# EAGLE design SUSTAINA-Power-Logging-Board (EAGLE 9.6.2)
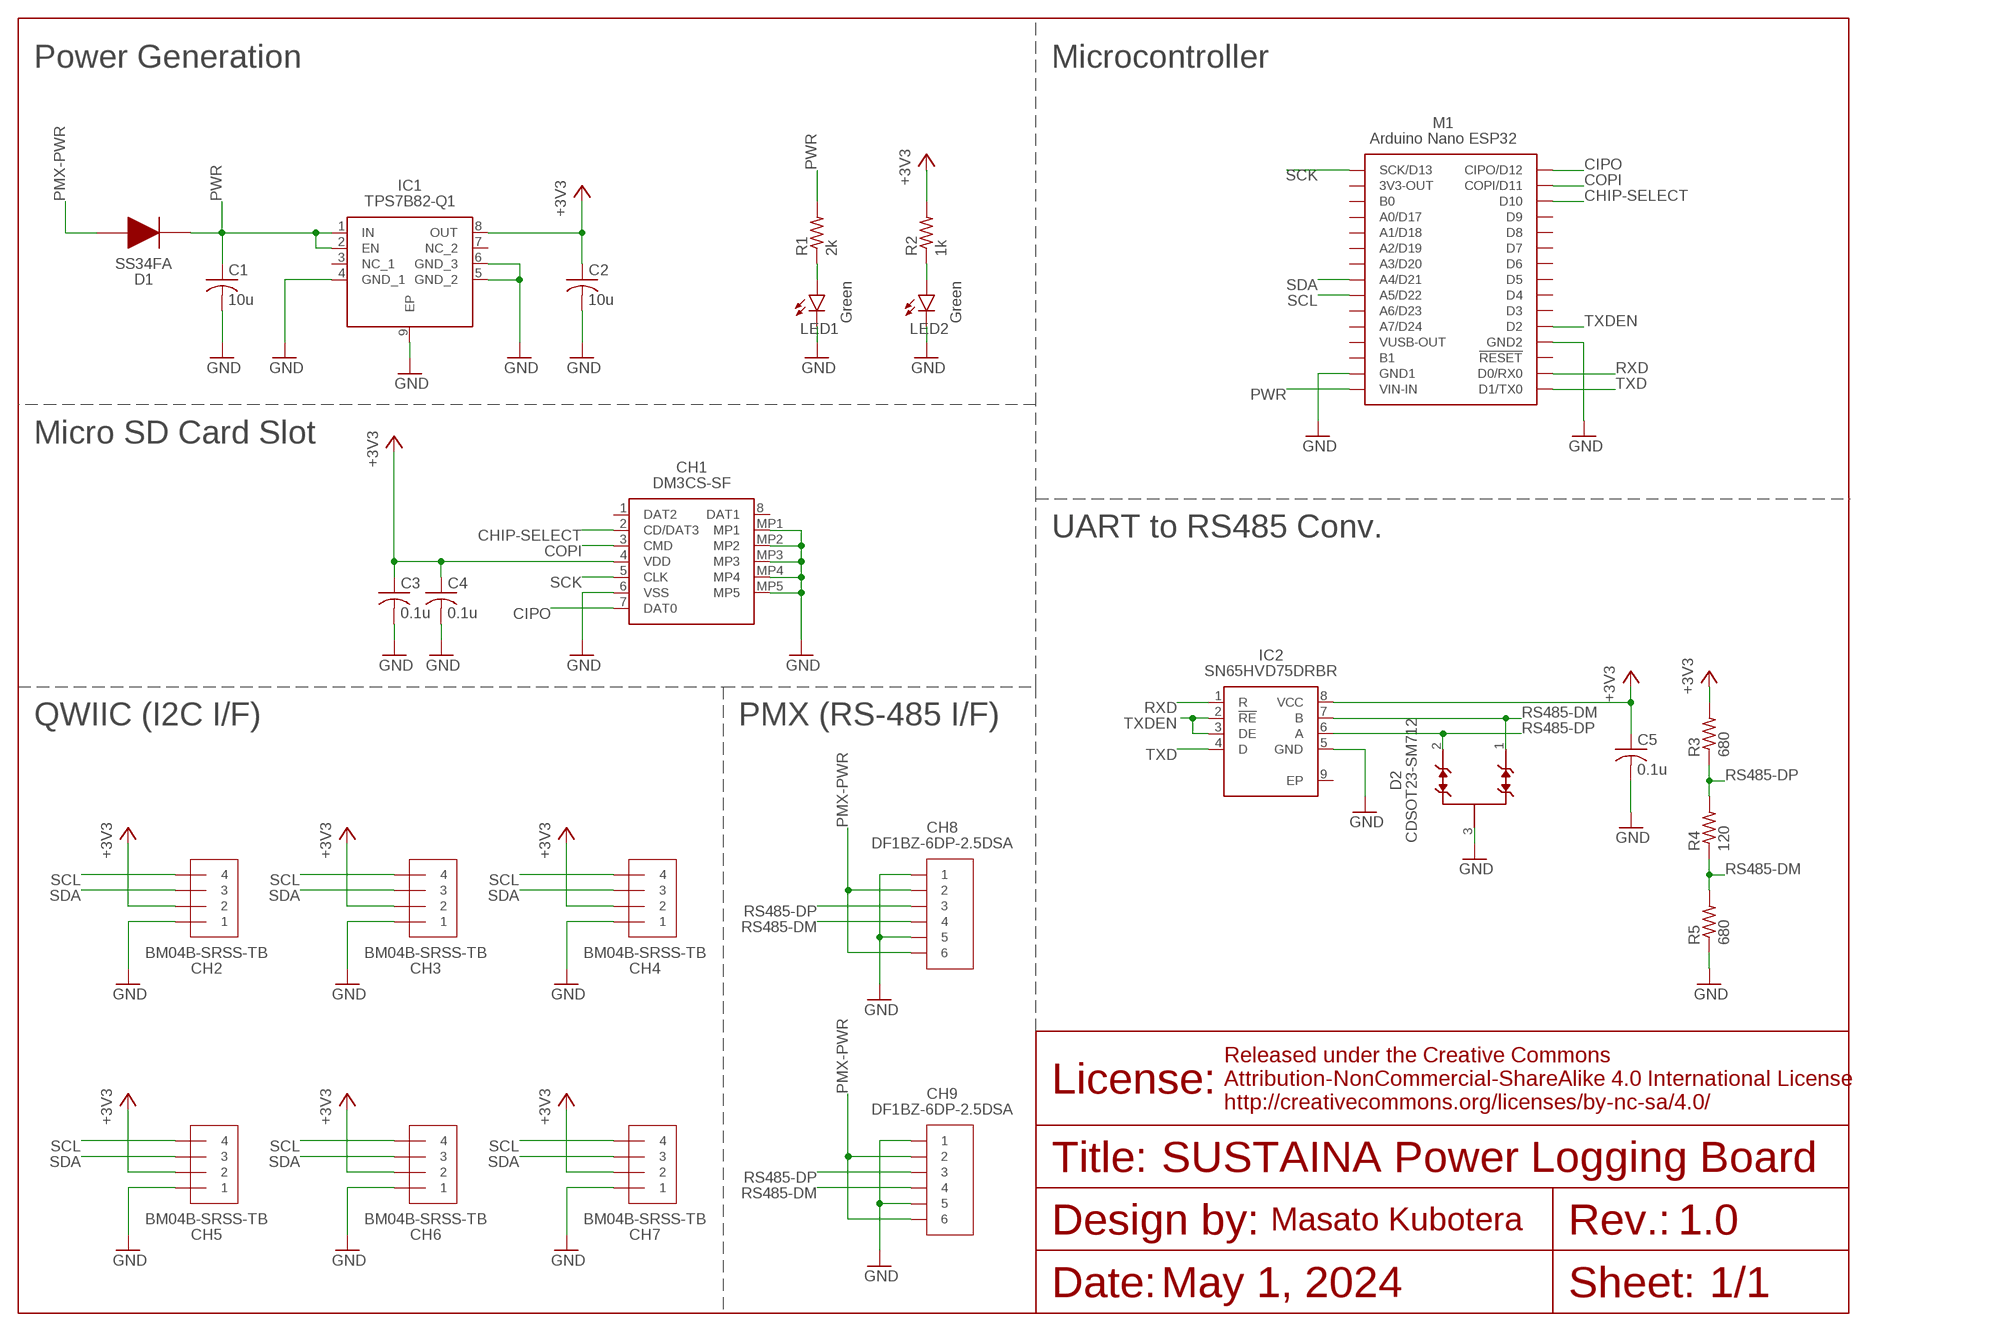
[diagram p0: schematic, sheet 1]

## Parts
C1  10u  C-USC0603  [C0603]
C2  10u  C-USC0603  [C0603]
C3  0.1u  C-USC0603  [C0603]
C4  0.1u  C-USC0603  [C0603]
C5  0.1u  C-USC0603  [C0603]
CH1  DM3CS-SF  [DM3CS-SF]
CH2  BM04B-SRSS-TB  [BM04B-SRSS-TB]
CH3  BM04B-SRSS-TB  [BM04B-SRSS-TB]
CH4  BM04B-SRSS-TB  [BM04B-SRSS-TB]
CH5  BM04B-SRSS-TB  [BM04B-SRSS-TB]
CH6  BM04B-SRSS-TB  [BM04B-SRSS-TB]
CH7  BM04B-SRSS-TB  [BM04B-SRSS-TB]
CH8  DF1BZ-6DP-25DSA  [DF1BZ-6DP-25DSA]
CH9  DF1BZ-6DP-25DSA  [DF1BZ-6DP-25DSA]
D1  SS34FA  [SS34FA]
D2  CDSOT23-SM712  [SOT-23-3]
IC1  TPS7B82-Q1  [SOP65P490X110-9N]
IC2  SN65HVD75DRBR  [SON65P300X300X100-9N]
LED1  Green  LEDSML0603  [SML0603]
LED2  Green  LEDSML0603  [SML0603]
M1  NANO-ESP32  [NANO-ESP32]
R1  2k  R-US_R0603  [R0603]
R2  1k  R-US_R0603  [R0603]
R3  680  R-US_R0603  [R0603]
R4  120  R-US_R0603  [R0603]
R5  680  R-US_R0603  [R0603]

## Nets
+3V3 [power]: C2.1 C3.1 C4.1 C5.1 CH1.4(VDD) CH2.2 CH3.2 CH4.2 CH5.2 CH6.2 CH7.2 IC1.8(OUT) IC2.8(VCC) R2.2 R3.2
CHIP-SELECT [signal]: CH1.2(CD/DAT3) M1.D10
CIPO [signal]: CH1.7(DAT0) M1.CIPO/D12
COPI [signal]: CH1.3(CMD) M1.COPI/D11
GND [power]: C1.2 C2.2 C3.2 C4.2 C5.2 CH1.6(VSS) CH1.MP1 CH1.MP2 CH1.MP3 CH1.MP4 CH1.MP5 CH2.1 CH3.1 CH4.1 CH5.1 CH6.1 CH7.1 CH8.1 CH8.5 CH9.1 CH9.5 D2.3 IC1.4(GND_1) IC1.5(GND_2) IC1.6(GND_3) IC1.9(EP) IC2.5(GND) LED1.C LED2.C M1.GND1 M1.GND2 R5.1
LED-3V3 [low-power]: LED2.A R2.1
LED-PWR [low-power]: LED1.A R1.1
PMX-PWR [high-power]: CH8.2 CH8.6 CH9.2 CH9.6 D1.2
PWR [high-power]: C1.1 D1.1 IC1.1(IN) IC1.2(EN) M1.VIN-IN R1.2
RS485-DM [signal]: CH8.4 CH9.4 D2.1 IC2.7(B) R4.1 R5.2
RS485-DP [signal]: CH8.3 CH9.3 D2.2 IC2.6(A) R3.1 R4.2
RXD [signal]: IC2.1(R) M1.D0/RX0
SCK [signal]: CH1.5(CLK) M1.SCK/D13
SCL [signal]: CH2.4 CH3.4 CH4.4 CH5.4 CH6.4 CH7.4 M1.A5/D22
SDA [signal]: CH2.3 CH3.3 CH4.3 CH5.3 CH6.3 CH7.3 M1.A4/D21
TXD [signal]: IC2.4(D) M1.D1/TX0
TXDEN [signal]: IC2.2(!RE) IC2.3(DE) M1.D2
Unconnected: CH1.1(DAT2) CH1.8(DAT1) IC1.3(NC_1) IC1.7(NC_2) IC2.9(EP) M1.3V3-OUT M1.!RESET M1.A0/D17 M1.A1/D18 M1.A2/D19 M1.A3/D20 M1.A6/D23 M1.A7/D24 M1.B0 M1.B1 M1.D3 M1.D4 M1.D5 M1.D6 M1.D7 M1.D8 M1.D9 M1.VUSB-OUT

## Notes on the sheet
- Power Generation | Microcontroller
- Micro SD Card Slot
- UART to RS485 Conv.
- QWIIC (I2C I/F) | PMX (RS-485 I/F)
- SUSTAINA Power Logging Board
- 1.0
- May 1, 2024 | 1/1

## Library data of the parts
C1-C5 = rcl:C-US: CAPACITOR, American symbol; SPICEPREFIX: C
CH1 = DM3CS-SF:DM3CS-SF
CH2-CH7 = SH-Connecters:BM04B-SRSS-TB
CH8 CH9 = DF1BZ-6DP-2.5DSA:DF1BZ-6DP-25DSA
D1 = SS34FA:SS34FA
D2 = CDSOT23-SM712:CDSOT23-SM712
IC1 = TPS7B82-Q1:TPS7B82-Q1
IC2 = SN65HVD75DRBR:SN65HVD75DRBR
LED1 LED2 = led:LED: LED OSRAM: - CHIPLED LG R971, LG N971, LY N971, LG Q971, LY Q971, LO R971, LY R971 LH N974, LH R974 LS Q976, LO Q976, LY Q976 LO Q996 - Hyper CHIPLED LW Q18S LB Q993, LB Q99A, LB R99A - SideLED LS A670, LO A670, LY A670, LG A670, LP A670 LB A673, LV A673, LT A673, LW A673 LH A674 LY A675 LS A676, LA A676, LO A676, LY A676, LW A676 LS A679, LY A679, LG A679 - Hyper Micro SIDELED® LS Y876, LA Y876, LO Y876, LY Y876 LT Y87S - SmartLED LW L88C, LW L88S LB L89C, LB L89S, LG L890 LS L89K, LO L89K, LY L89K LS L896, LA L896, LO L896, LY L896 - TOPLED LS T670, LO T670, LY T670, LG T670, LP T670 LSG T670, LSP T670, LSY T670, LOP T670, LYG T670 LG T671, LOG T671, LSG T671 LB T673, LV T673, LT T673, LW T673 LH T674 LS T676, LA T676, LO T676, LY T676, LB T676, LH T676, LSB T676, LW T676 LB T67C, LV T67C, LT T67C, LS T67K, LO T67K, LY T67K, LW E67C LS E67B, LA E67B, LO E67B, LY E67B, LB E67C, LV E67C, LT E67C LW T67C LS T679, LY T679, LG T679 LS T770, LO T770, LY T770, LG T770, LP T770 LB T773, LV T773, LT T773, LW T773 LH T774 LS E675, LA E675, LY E675, LS T675 LS T776, LA T776, LO T776, LY T776, LB T776 LHGB T686 LT T68C, LB T68C - Hyper Mini TOPLED® LB M676 - Mini TOPLED Santana® LG M470 LS M47K, LO M47K, LY M47K Source: http://www.osram.convergy.de LUXEON: - LUMILED® LXK2-PW12-R00, LXK2-PW12-S00, LXK2-PW14-U00, LXK2-PW14-V00 LXK2-PM12-R00, LXK2-PM12-S00, LXK2-PM14-U00 LXK2-PE12-Q00, LXK2-PE12-R00, LXK2-PE12-S00, LXK2-PE14-T00, LXK2-PE14-U00 LXK2-PB12-K00, LXK2-PB12-L00, LXK2-PB12-M00, LXK2-PB14-N00, LXK2-PB14-P00, LXK2-PB14-Q00 LXK2-PR12-L00, LXK2-PR12-M00, LXK2-PR14-Q00, LXK2-PR14-R00 LXK2-PD12-Q00, LXK2-PD12-R00, LXK2-PD12-S00 LXK2-PH12-R00, LXK2-PH12-S00 LXK2-PL12-P00, LXK2-PL12-Q00, LXK2-PL12-R00 Source: www.luxeon.com KINGBRIGHT: KA-3528ASYC Source: www.kingbright.com
M1 = Arduino:NANO-ESP32
R1-R5 = rcl:R-US_: RESISTOR, American symbol; SPICEPREFIX: R

## Net classes
1 signal: width 0.203 mm, clearance 0.127 mm
2 power: width 0.381 mm
3 low-power: width 0.254 mm
4 high-power: width 0.508 mm

## Board
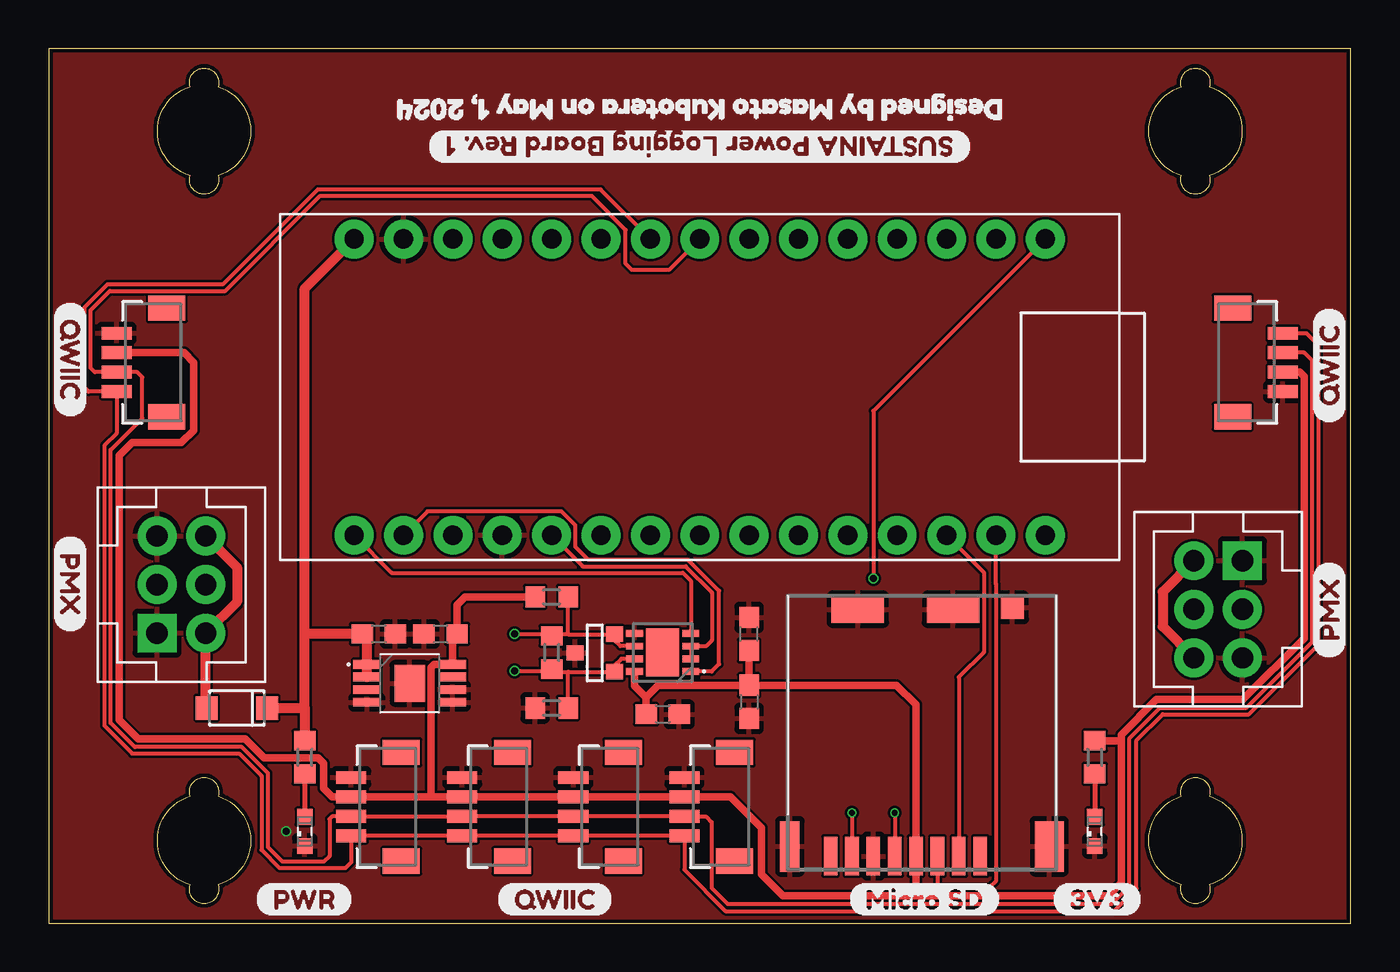
[diagram p1: board, top side]
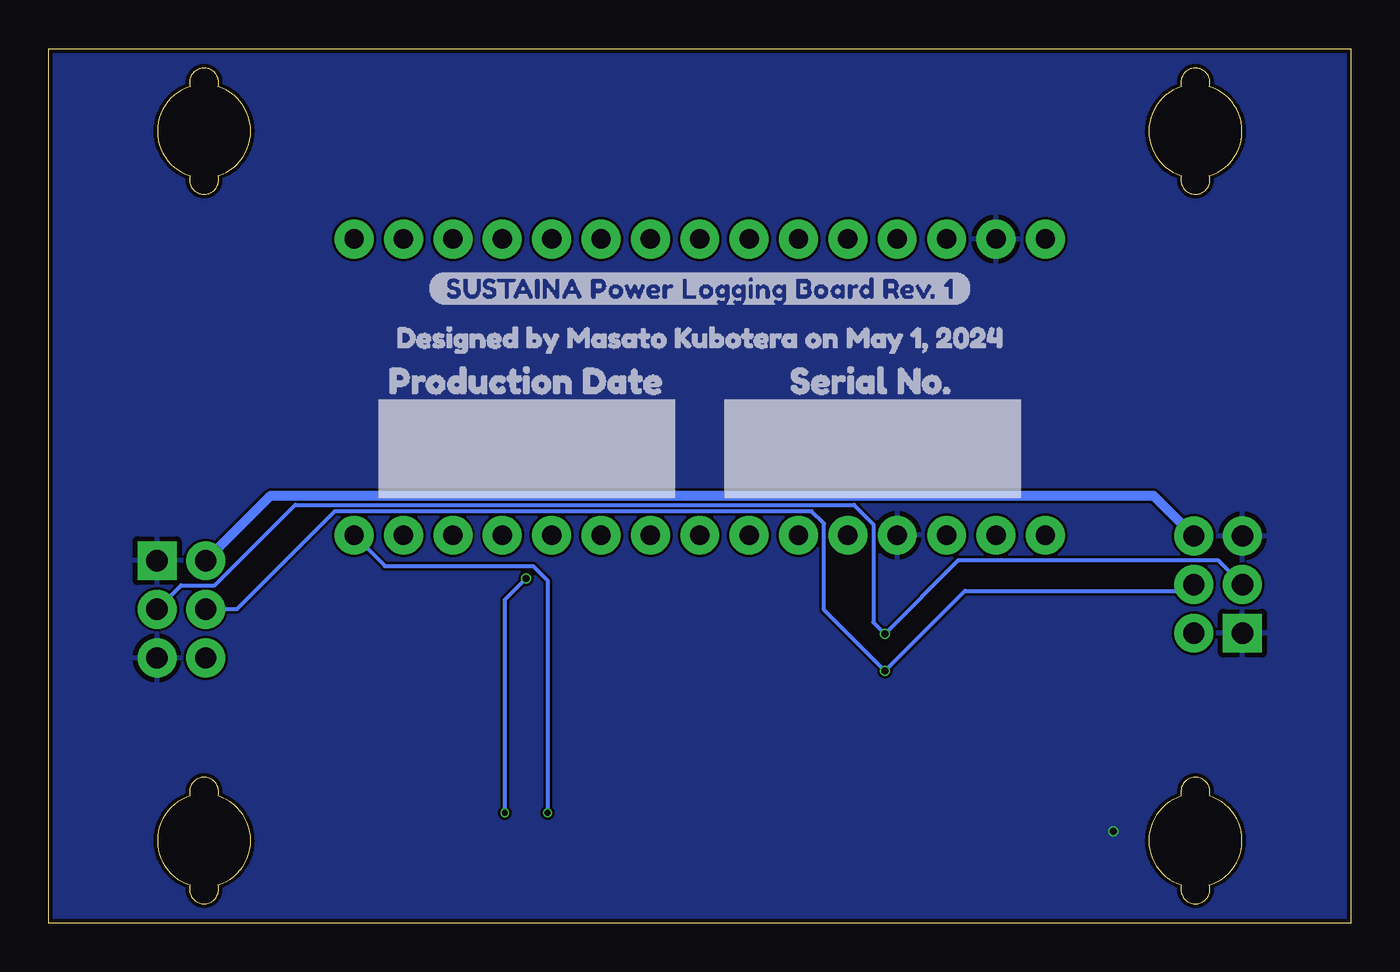
[diagram p2: board, bottom side, seen from below]

Size 67 x 45 mm. Coordinates in mm from the lower left corner, seen from the top.
Outline: 67,45 0,45 0,0 67,0 67,45
Outline: 8.72,1.96 arc-213 7.28,1.96 arc-145 7.28,6.54 arc-213 8.72,6.54 arc-145 8.72,1.96
Outline: 59.72,1.96 arc-213 58.28,1.96 arc-145 58.28,6.54 arc-213 59.72,6.54 arc-145 59.72,1.96
Outline: 58.28,43.04 arc-213 59.72,43.04 arc-145 59.72,38.46 arc-213 58.28,38.46 arc-145 58.28,43.04
Outline: 7.28,43.04 arc-213 8.72,43.04 arc-145 8.72,38.46 arc-213 7.28,38.46 arc-145 7.28,43.04
Copper layers (1*16): Top 0.035mm / dielectric 1.6mm / Bottom 0.035mm
Design rules "jlcpcb-2layers": minimum track width 5mil, minimum drill 0.3mm, track to track 5mil, track to pad 5mil, pad to pad 5mil, via to via 5mil, smd to smd 5mil, copper to edge 0.2mm, drill to drill 6mil, minimum pad ring 10mil, minimum via ring 3mil, stop-mask expansion 4mil, vias tented up to drill 0mil, thermal gap 10mil

### Footprints (pad centres in the part's own frame; a part is rotated, then mirrored left to right if it is on the bottom)
C0603 = smd 1.1 x 1: 1 -0.85,0; 2 0.85,0
DM3CS-SF = smd 0.7 x 2: 1 3,1.27; 2 1.9,1.27; 3 0.8,1.27; 4 -0.3,1.27; 5 -1.4,1.27; 6 -2.5,1.27; 7 -3.6,1.27; 8 -4.7,1.27 | smd 1 x 2.6: MP1 -6.8,1.77 | smd 1.5 x 2.6: MP2 6.55,1.77 | smd 2.7 x 1.4: MP3 -3.3,13.97; MP4 1.6,13.97 | smd 1.2 x 1.2: MP5 4.65,14.07
BM04B-SRSS-TB = smd 0.66 x 1.549: 1 1.5,3.33; 2 0.5,3.33; 3 -0.5,3.33; 4 -1.5,3.33 | smd 1.295 x 1.905: 5 2.8,0.75; 6 -2.8,0.75
DF1BZ-6DP-25DSA = drill 1.1 pad 2 square: 1 -2.5,1.25 | drill 1.1 pad 2: 2 -2.5,-1.25; 3 0,1.25; 4 0,-1.25; 5 2.5,1.25; 6 2.5,-1.25
SS34FA = smd 1.12 x 1.22: 1 -1.55,0; 2 1.55,0
SOT-23-3 = smd 0.787 x 0.889: 1 0.991,1.016; 2 -0.94,1.016; 3 0.025,-1.016
SOP65P490X110-9N = smd 1.4 x 0.45: 1 -2.2,0.975; 2 -2.2,0.325; 3 -2.2,-0.325; 4 -2.2,-0.975; 5 2.2,-0.975; 6 2.2,-0.325; 7 2.2,0.325; 8 2.2,0.975 | smd 1.57 x 1.89: 9 0,0
SON65P300X300X100-9N = smd 0.85 x 0.35: 1 -1.45,0.975; 2 -1.45,0.325; 3 -1.45,-0.325; 4 -1.45,-0.975; 5 1.45,-0.975; 6 1.45,-0.325; 7 1.45,0.325; 8 1.45,0.975 | smd 1.7 x 2.45: 9 0,0
SML0603 = smd 0.8 x 0.8: A 0.75,0; C -0.75,0
NANO-ESP32 = drill 1 pad 2: 3V3-OUT -7.62,15.24; !RESET 7.62,-12.7; A0/D17 -7.62,10.16; A1/D18 -7.62,7.62; A2/D19 -7.62,5.08; A3/D20 -7.62,2.54; A4/D21 -7.62,0; A5/D22 -7.62,-2.54; A6/D23 -7.62,-5.08; A7/D24 -7.62,-7.62; B0 -7.62,12.7; B1 -7.62,-12.7; CIPO/D12 7.62,17.78; COPI/D11 7.62,15.24; D0/RX0 7.62,-15.24; D1/TX0 7.62,-17.78; D2 7.62,-7.62; D3 7.62,-5.08; D4 7.62,-2.54; D5 7.62,0; D6 7.62,2.54; D7 7.62,5.08; D8 7.62,7.62; D9 7.62,10.16; D10 7.62,12.7; GND1 -7.62,-15.24; GND2 7.62,-10.16; SCK/D13 -7.62,17.78; VIN-IN -7.62,-17.78; VUSB-OUT -7.62,-10.16
R0603 = smd 1 x 1.1: 1 -0.85,0; 2 0.85,0

### Placement (x,y rotation side)
C1  16.99,14.88 0 top
C2  20.16,14.88 180 top
C3  36.04,11.39 270 top
C4  36.04,14.88 90 top
C5  31.59,10.75 0 top
CH1  44.93,2.18 0 top
CH2  18.89,5.99 90 top
CH3  24.61,5.99 90 top
CH4  30.32,5.99 90 top
CH5  60.17,28.85 270 top
CH6  6.83,28.85 90 top
CH7  36.04,5.99 90 top
CH8  6.83,17.42 90 top
CH9  60.17,16.15 270 top
D1  9.69,11.07 180 top
D2  28.1,13.93 270 top
IC1  18.58,12.34 0 top
IC2  31.59,13.93 180 top
LED1  13.18,4.72 90 top
LED2  53.82,4.72 90 top
M1  33.5,27.58 270 top
R1  13.18,8.53 90 top
R2  53.82,8.53 90 top
R3  25.88,16.79 180 top
R4  25.88,13.93 90 top
R5  25.88,11.07 0 top
U$1  [PMX]  65.88,13.61 90 top
U$2  [3V3]  51.6,1.23 0 top
U$3  [MICRO_SD]  41.12,1.23 0 top
U$4  [QWIIC]  23.02,1.23 0 top
U$5  [QWIIC]  1.12,32.02 270 top
U$6  PRODUCTION_DATE0  [PRODUCTION_DATE0]  50.64,27.9 0 bottom
U$7  SERIAL_NO#0  [SERIAL_NO#0]  30.01,27.9 0 bottom
U$8  [DESIGNED_BY_MASATO_KUBOTERA_ON_MAY_1]  50.01,41.87 180 top
U$9  [DESIGNED_BY_MASATO_KUBOTERA_ON_MAY_1]  50.01,30.12 0 bottom
U$10  [QWIIC]  65.88,25.68 90 top
U$11  [SUSTAINA_POWER_LOGGING_BOARD_REV#_1]  47.47,32.66 0 bottom
U$12  [PMX]  1.12,19.96 270 top
U$13  [PWR]  10.64,1.23 0 top
U$14  [SUSTAINA_POWER_LOGGING_BOARD_REV#_1]  47.47,39.96 180 top

### Tracks (layer width: path | path; a pad name or v marks a point on that pad's centre or on a via)
+3V3
  Top 0.381: 44.63,1.4 CH1.4 44.61,3.45 44.61,11.25 43.63,12.24 C3.1 | 30.96,10.75 C5.1 30.75,11.62 | 30.75,11.62 30.14,12.22 IC2.8 | 30.75,11.62 31.36,12.24 C3.1 | C4.1 C3.1 | R3.2 21.44,16.79 21.02,16.37 C2.1 20.78,14.64 IC1.8 19.82,13.32 19.68,13.17 19.68,6.49 | 19.68,6.49 CH3.2 CH4.2 CH7.2 35.09,6.49 36.68,4.9 36.68,2.52 37.79,1.4 44.63,1.4 | R2.2 55.19,9.38 | CH6.2 6.96,29.35 7.46,28.85 7.46,25.36 6.83,24.72 4.29,24.72 3.63,24.06 3.63,10.46 4.61,9.48 10.11,9.48 11.1,8.5 13.86,8.5 14.15,8.21 14.15,6.93 14.59,6.49 CH2.2 19.68,6.49 | 55.19,9.38 55.19,2.07 54.52,1.4 44.63,1.4 | 55.19,9.38 55.19,9.69 57,11.5 61.45,11.5 64.59,14.65 64.59,28.13 64.37,28.35 CH5.2
CHIP-SELECT
  Top 0.203: CH1.2 46.83,12.66 48.11,13.94 48.11,18.05 M1.D10
CIPO  (via drill 0.3)
  Top 0.203: v41.33,5.67 CH1.7
  Bottom 0.203: M1.CIPO/D12 49.69,18.37 42.08,18.37 41.33,17.63 v41.33,5.67
COPI
  Top 0.203: CH1.3 45.73,2.02 45.88,1.86 48.42,1.86 48.75,2.19 48.75,17.43 48.74,17.42 M1.COPI/D11
GND  (via drill 0.35)
  other vias: 12.23,4.72
  pour Top: -2.06,-4.17 69.06,-4.17 69.06,46.63 -2.06,46.63
  pour Bottom: -4.6,-6.71 71.6,-6.71 71.6,49.17 -4.6,49.17
LED-3V3
  Top 0.254: R2.1 LED2.A
LED-PWR
  Top 0.254: R1.1 LED1.A
PMX-PWR
  Top 0.508: CH9.6 57.31,15.26 57.31,17.04 CH9.2 | CH8.6 9.69,18.31 9.69,16.53 CH8.2 8.08,11.43 8.14,11.43 D1.2
  Bottom 0.508: CH8.6 10.16,22 55.57,22 CH9.2
PWR
  Top 0.508: D1.1 13.18,11.07 | 13.18,11.07 13.18,14.88 | 13.18,14.88 13.18,32.66 M1.VIN-IN | IC1.2 IC1.1 16.38,14.64 C1.1 13.18,14.88 | 13.18,11.07 R1.2
RS485-DM  (via drill 0.35)
  Top 0.203: IC2.7 29.47,13.6 29.12,13.25 D2.1 26.73,12.94 | 26.73,12.94 26.02,12.94 R4.1 25.78,12.97 v23.98,12.97 | R5.2 26.73,12.94
  Bottom 0.203: CH8.4 8.4,17.1 19.85,17.1 v23.98,12.97 27.11,16.11 27.11,20.55 27.74,21.19 52.27,21.19 57.31,16.15 CH9.4
RS485-DP  (via drill 0.35)
  Top 0.203: IC2.6 29.42,14.25 29.12,14.55 D2.2 26.73,14.87 | 26.73,14.87 25.97,14.87 R4.2 25.78,14.88 v23.98,14.88 | 26.73,14.87 R3.1
  Bottom 0.203: CH8.3 6.81,18.65 20.21,18.65 v23.98,14.88 24.57,15.47 24.57,20.53 25.56,21.52 54.31,21.52 58.45,17.38 60.19,17.38 CH9.3
RXD
  Top 0.203: M1.D0/RX0 19.49,21.19 26.39,21.19 27.11,20.47 27.11,19.37 27.79,18.69 32.91,18.69 34.49,17.1 34.49,13.33 34.11,12.95 IC2.1
SCK  (via drill 0.3, 0.35)
  Top 0.203: v43.53,5.67 CH1.5 | v42.43,17.74 42.43,26.35 M1.SCK/D13
  Bottom 0.203: v43.53,5.67 43.53,16.64 v42.43,17.74
SCL
  Top 0.203: CH5.4 64.7,30.35 65.34,29.71 65.34,14.34 61.76,10.75 57.31,10.75 55.97,9.41 55.97,1.79 54.8,0.62 34.84,0.62 32.71,2.75 CH7.4 CH4.4 CH3.4 CH2.4 15.57,3.13 15.26,2.83 11.9,2.83 10.96,3.77 10.96,7.58 9.8,8.73 4.3,8.73 2.86,10.17 2.86,24.57 3.5,25.2 CH6.4 2.06,27.35 1.83,27.58 1.83,31.67 3.02,32.86 8.95,32.86 13.85,37.75 28.41,37.75 M1.A5/D22
SDA
  Top 0.203: CH5.3 64.6,29.35 65.01,28.94 65.01,14.47 61.62,11.08 57.18,11.08 55.61,9.52 55.61,1.9 54.7,0.98 34.94,0.98 34.11,1.81 34.11,5.2 33.82,5.49 CH7.3 CH4.3 CH3.3 CH2.3 14.59,5.49 14.45,5.36 14.45,3.45 14.16,3.16 12.03,3.16 11.29,3.9 11.29,7.71 9.94,9.06 4.43,9.06 3.2,10.3 3.2,24.35 4.82,25.97 4.82,28.09 4.56,28.35 CH6.3 2.39,28.35 2.16,28.57 2.16,31.53 3.16,32.53 9.09,32.53 13.98,37.42 27.93,37.42 29.69,35.67 29.69,33.93 30.01,33.61 31.91,33.61 M1.A4/D21
TXD
  Top 0.203: M1.D1/TX0 17.65,18.03 32.63,18.03 33.05,17.62 IC2.4
TXDEN
  Top 0.203: IC2.2 IC2.3 33.05,14.25 33.82,14.25 34.12,14.55 34.12,17.01 32.77,18.36 27.47,18.36 27.47,18.37 M1.D2